# EAGLE design All_capacitors (EAGLE 6.3)
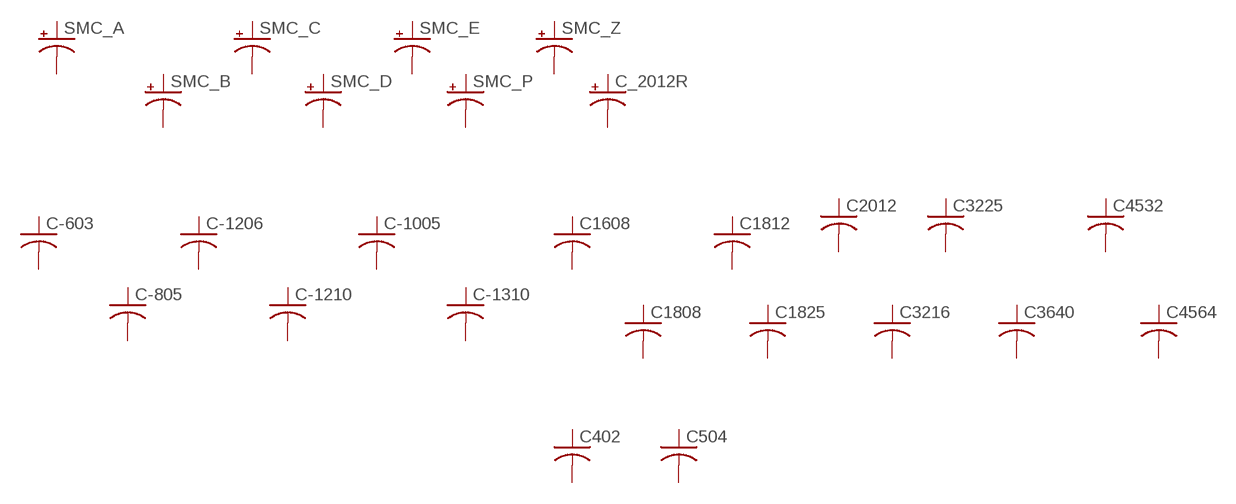
[diagram p0: schematic, sheet 1]

## Parts
C402  C-USC0402  [C0402]
C504  C-USC0504  [C0504]
C1608  C-USC1608  [C1608]
C1808  C-USC1808  [C1808]
C1812  C-USC1812  [C1812]
C1825  C-USC1825  [C1825]
C2012  C-USC2012  [C2012]
C3216  C-USC3216  [C3216]
C3225  C-USC0603  [C0603]
C3640  C-USC3640  [C3640]
C4532  C-USC4532  [C4532]
C4564  C-USC4564  [C4564]
C-603  C-USC0603  [C0603]
C-805  C-USC0805  [C0805]
C-1005  C-USC1005  [C1005]
C-1206  C-USC1206  [C1206]
C-1210  C-USC1210  [C1210]
C-1310  C-USC1310  [C1310]
C_2012R  CPOL-USR/2012-12R  [R/2012-12R]
SMC_A  CPOL-USSMCA  [SMC_A]
SMC_B  CPOL-USSMCB  [SMC_B]
SMC_C  CPOL-USSMCC  [SMC_C]
SMC_D  CPOL-USSMCD  [SMC_D]
SMC_E  CPOL-USSMCE  [SMC_E]
SMC_P  CPOL-USSMCP  [SMC_P]
SMC_Z  CPOL-USSMCZ  [SMC_Z]
Unconnected: C402.1 C402.2 C504.1 C504.2 C1608.1 C1608.2 C1808.1 C1808.2 C1812.1 C1812.2 C1825.1 C1825.2 C2012.1 C2012.2 C3216.1 C3216.2 C3225.1 C3225.2 C3640.1 C3640.2 C4532.1 C4532.2 C4564.1 C4564.2 C-603.1 C-603.2 C-805.1 C-805.2 C-1005.1 C-1005.2 C-1206.1 C-1206.2 C-1210.1 C-1210.2 C-1310.1 C-1310.2 C_2012R.+ C_2012R.- SMC_A.+ SMC_A.- SMC_B.+ SMC_B.- SMC_C.+ SMC_C.- SMC_D.+ SMC_D.- SMC_E.+ SMC_E.- SMC_P.+ SMC_P.- SMC_Z.+ SMC_Z.-

## Library data of the parts
C402 C504 C1608 C1808 C1812 C1825 C2012 C3216 C3225 C3640 C4532 C4564 C-603 C-805 C-1005 C-1206 C-1210 C-1310 = rcl:C-US: CAPACITOR, American symbol
C_2012R SMC_A SMC_B SMC_C SMC_D SMC_E SMC_P SMC_Z = rcl:CPOL-US: POLARIZED CAPACITOR, American symbol

## Board
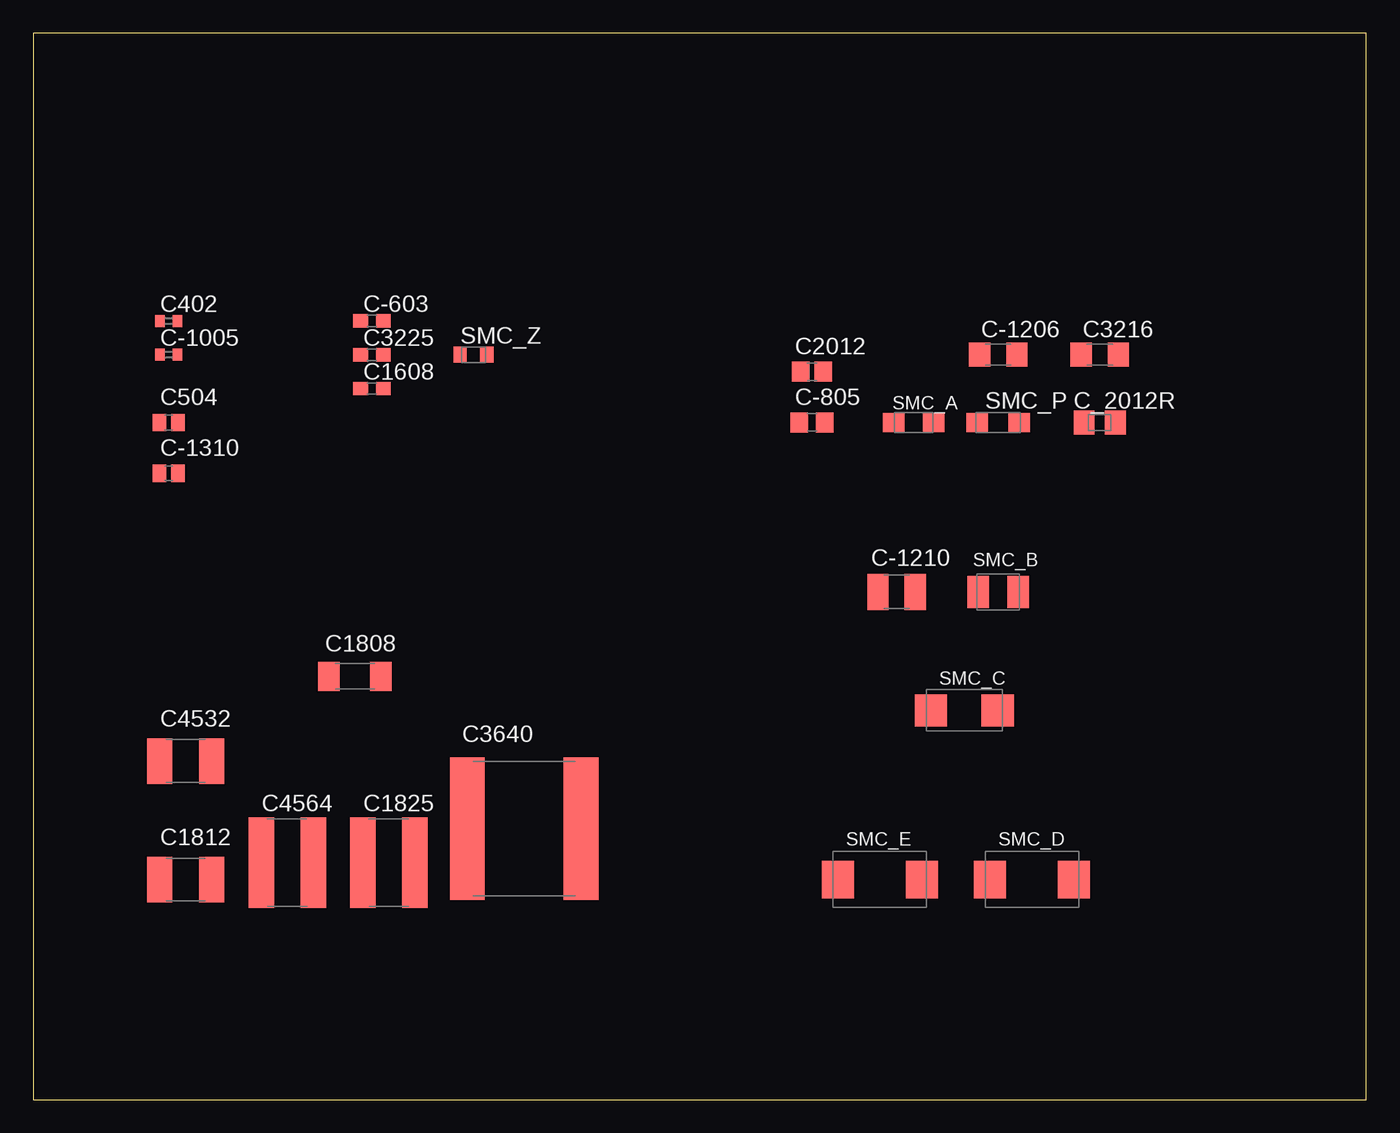
[diagram p1: board, top side]
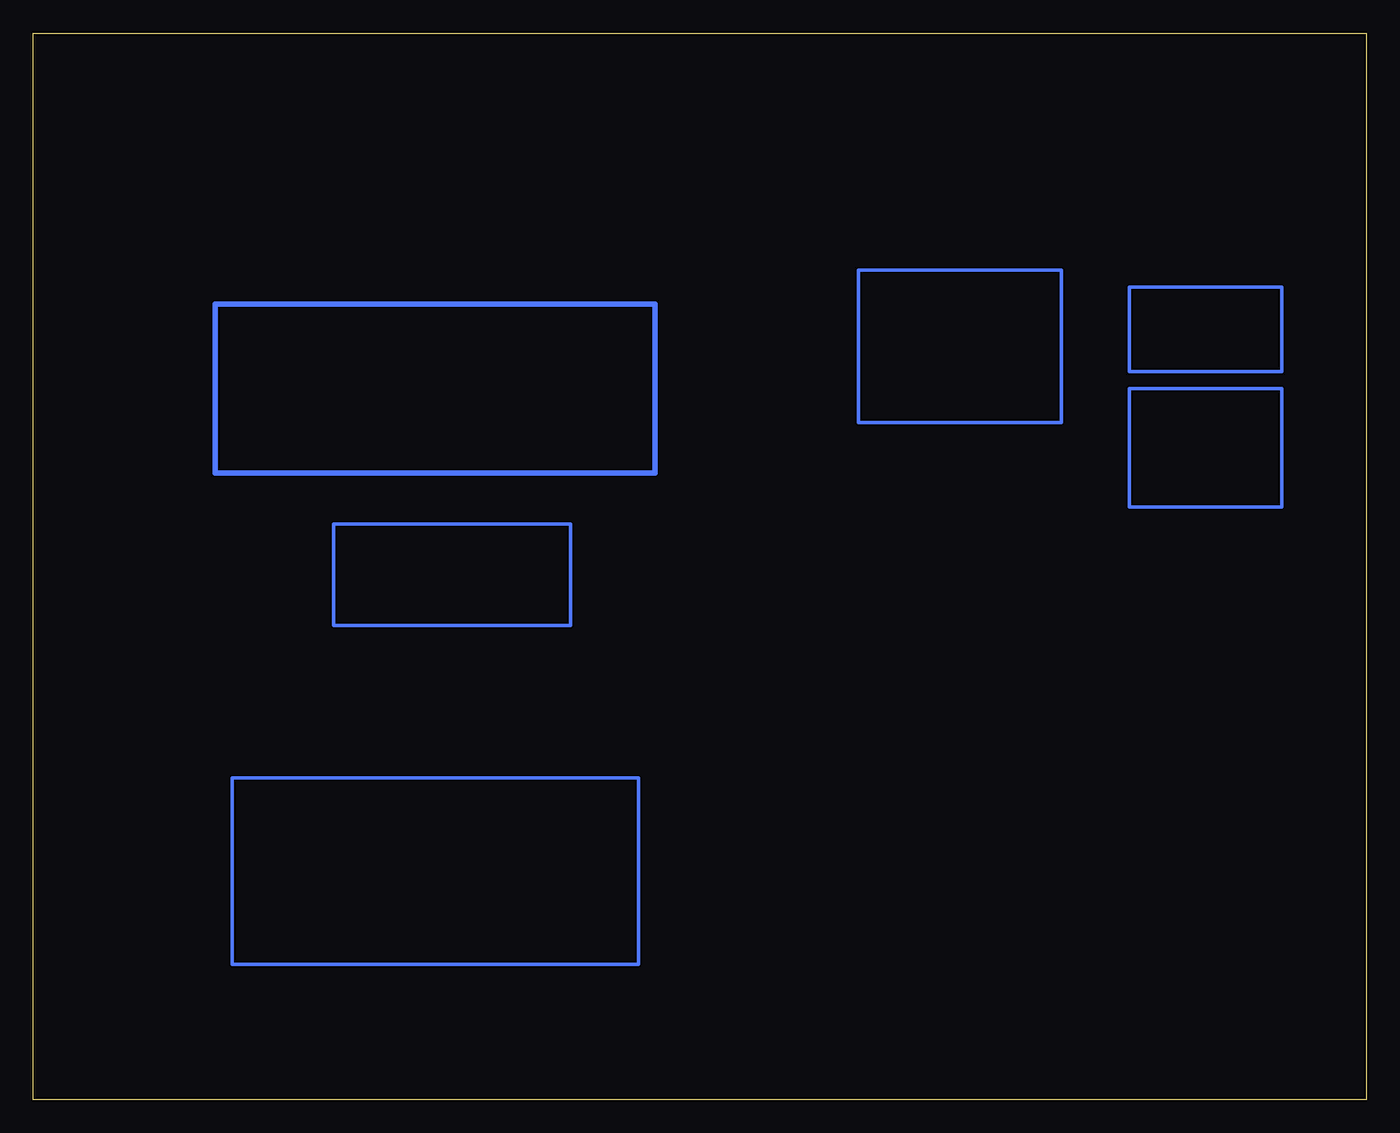
[diagram p2: board, bottom side, seen from below]

Size 100 x 80 mm. Coordinates in mm from the lower left corner, seen from the top.
Outline: 0,0 100,0 100,80 0,80 0,0
Copper layers (1*16): Top 0.035mm / dielectric 1.5mm / Bottom 0.035mm
Design rules "default": minimum track width 10mil, minimum drill 24mil, track to track 8mil, track to pad 8mil, pad to pad 8mil, via to via 8mil, smd to smd 8mil, copper to edge 40mil, drill to drill 8mil, minimum pad ring 10mil, minimum via ring 8mil, stop-mask expansion 4mil, vias tented up to drill 0mil, thermal gap 10mil

### Footprints (pad centres in the part's own frame; a part is rotated, then mirrored left to right if it is on the bottom)
C0402 = smd 0.7 x 0.9: 1 -0.65,0; 2 0.65,0
C0504 = smd 1 x 1.3: 1 -0.7,0; 2 0.7,0
C1608 = smd 1.1 x 1: 1 -0.85,0; 2 0.85,0
C1808 = smd 1.6 x 2.2: 1 -1.95,0; 2 1.95,0
C1812 = smd 1.9 x 3.4: 1 -1.95,0; 2 1.95,0
C1825 = smd 1.9 x 6.8: 1 -1.95,0; 2 1.95,0
C2012 = smd 1.3 x 1.5: 1 -0.85,0; 2 0.85,0
C3216 = smd 1.6 x 1.8: 1 -1.4,0; 2 1.4,0
C0603 = smd 1.1 x 1: 1 -0.85,0; 2 0.85,0
C3640 = smd 2.6 x 10.7: 1 -4.267,0; 2 4.267,0
C4532 = smd 1.9 x 3.4: 1 -1.95,0; 2 1.95,0
C4564 = smd 1.9 x 6.8: 1 -1.95,0; 2 1.95,0
C0805 = smd 1.3 x 1.5: 1 -0.95,0; 2 0.95,0
C1005 = smd 0.7 x 0.9: 1 -0.65,0; 2 0.65,0
C1206 = smd 1.6 x 1.8: 1 -1.4,0; 2 1.4,0
C1210 = smd 1.6 x 2.7: 1 -1.4,0; 2 1.4,0
C1310 = smd 1 x 1.3: 1 -0.7,0; 2 0.7,0
R/2012-12R = smd 1.55 x 1.8: + 1.175,0; - -1.175,0
SMC_A = smd 1.6 x 1.4: + -1.5,0; - 1.5,0
SMC_B = smd 1.6 x 2.4: + -1.5,0; - 1.5,0
SMC_C = smd 2.4 x 2.4: + -2.5,0; - 2.5,0
SMC_D = smd 2.4 x 2.8: + -3.15,0; - 3.15,0
SMC_E = smd 2.4 x 2.8: + -3.15,0; - 3.15,0
SMC_P = smd 1.6 x 1.4: + -1.575,0; - 1.575,0
SMC_Z = smd 1 x 1.2: + -1,0; - 1,0

### Placement (x,y rotation side)
C402  10.16,58.42 0 top
C504  10.16,50.8 0 top
C1608  25.4,53.34 0 top
C1808  24.13,31.75 0 top
C1812  11.43,16.51 0 top
C1825  26.67,17.78 0 top
C2012  58.42,54.61 0 top
C3216  80.01,55.88 0 top
C3225  25.4,55.88 0 top
C3640  36.83,20.32 0 top
C4532  11.43,25.4 0 top
C4564  19.05,17.78 0 top
C-603  25.4,58.42 0 top
C-805  58.42,50.8 0 top
C-1005  10.16,55.88 0 top
C-1206  72.39,55.88 0 top
C-1210  64.77,38.1 0 top
C-1310  10.16,46.99 0 top
C_2012R  80.01,50.8 0 top
SMC_A  66.04,50.8 0 top
SMC_B  72.39,38.1 0 top
SMC_C  69.85,29.21 0 top
SMC_D  74.93,16.51 0 top
SMC_E  63.5,16.51 0 top
SMC_P  72.39,50.8 0 top
SMC_Z  33.02,55.88 0 top

### Tracks (layer width: path | path; a pad name or v marks a point on that pad's centre or on a via)
N$1
  Bottom 0.406: 53.34,59.69 86.36,59.69 86.36,46.99 53.34,46.99 53.34,59.69
N$2
  Bottom 0.254: 22.86,62.23 38.1,62.23 38.1,50.8 22.86,50.8 22.86,62.23
N$3
  Bottom 0.254: 59.69,43.18 77.47,43.18 77.47,35.56 59.69,35.56 59.69,43.18
N$4
  Bottom 0.254: 54.61,24.13 85.09,24.13 85.09,10.16 54.61,10.16 54.61,24.13
N$5
  Bottom 0.254: 6.35,60.96 17.78,60.96 17.78,54.61 6.35,54.61 6.35,60.96
N$6
  Bottom 0.254: 6.35,53.34 17.78,53.34 17.78,44.45 6.35,44.45 6.35,53.34